# EAGLE design TFG (EAGLE 7.3.0)
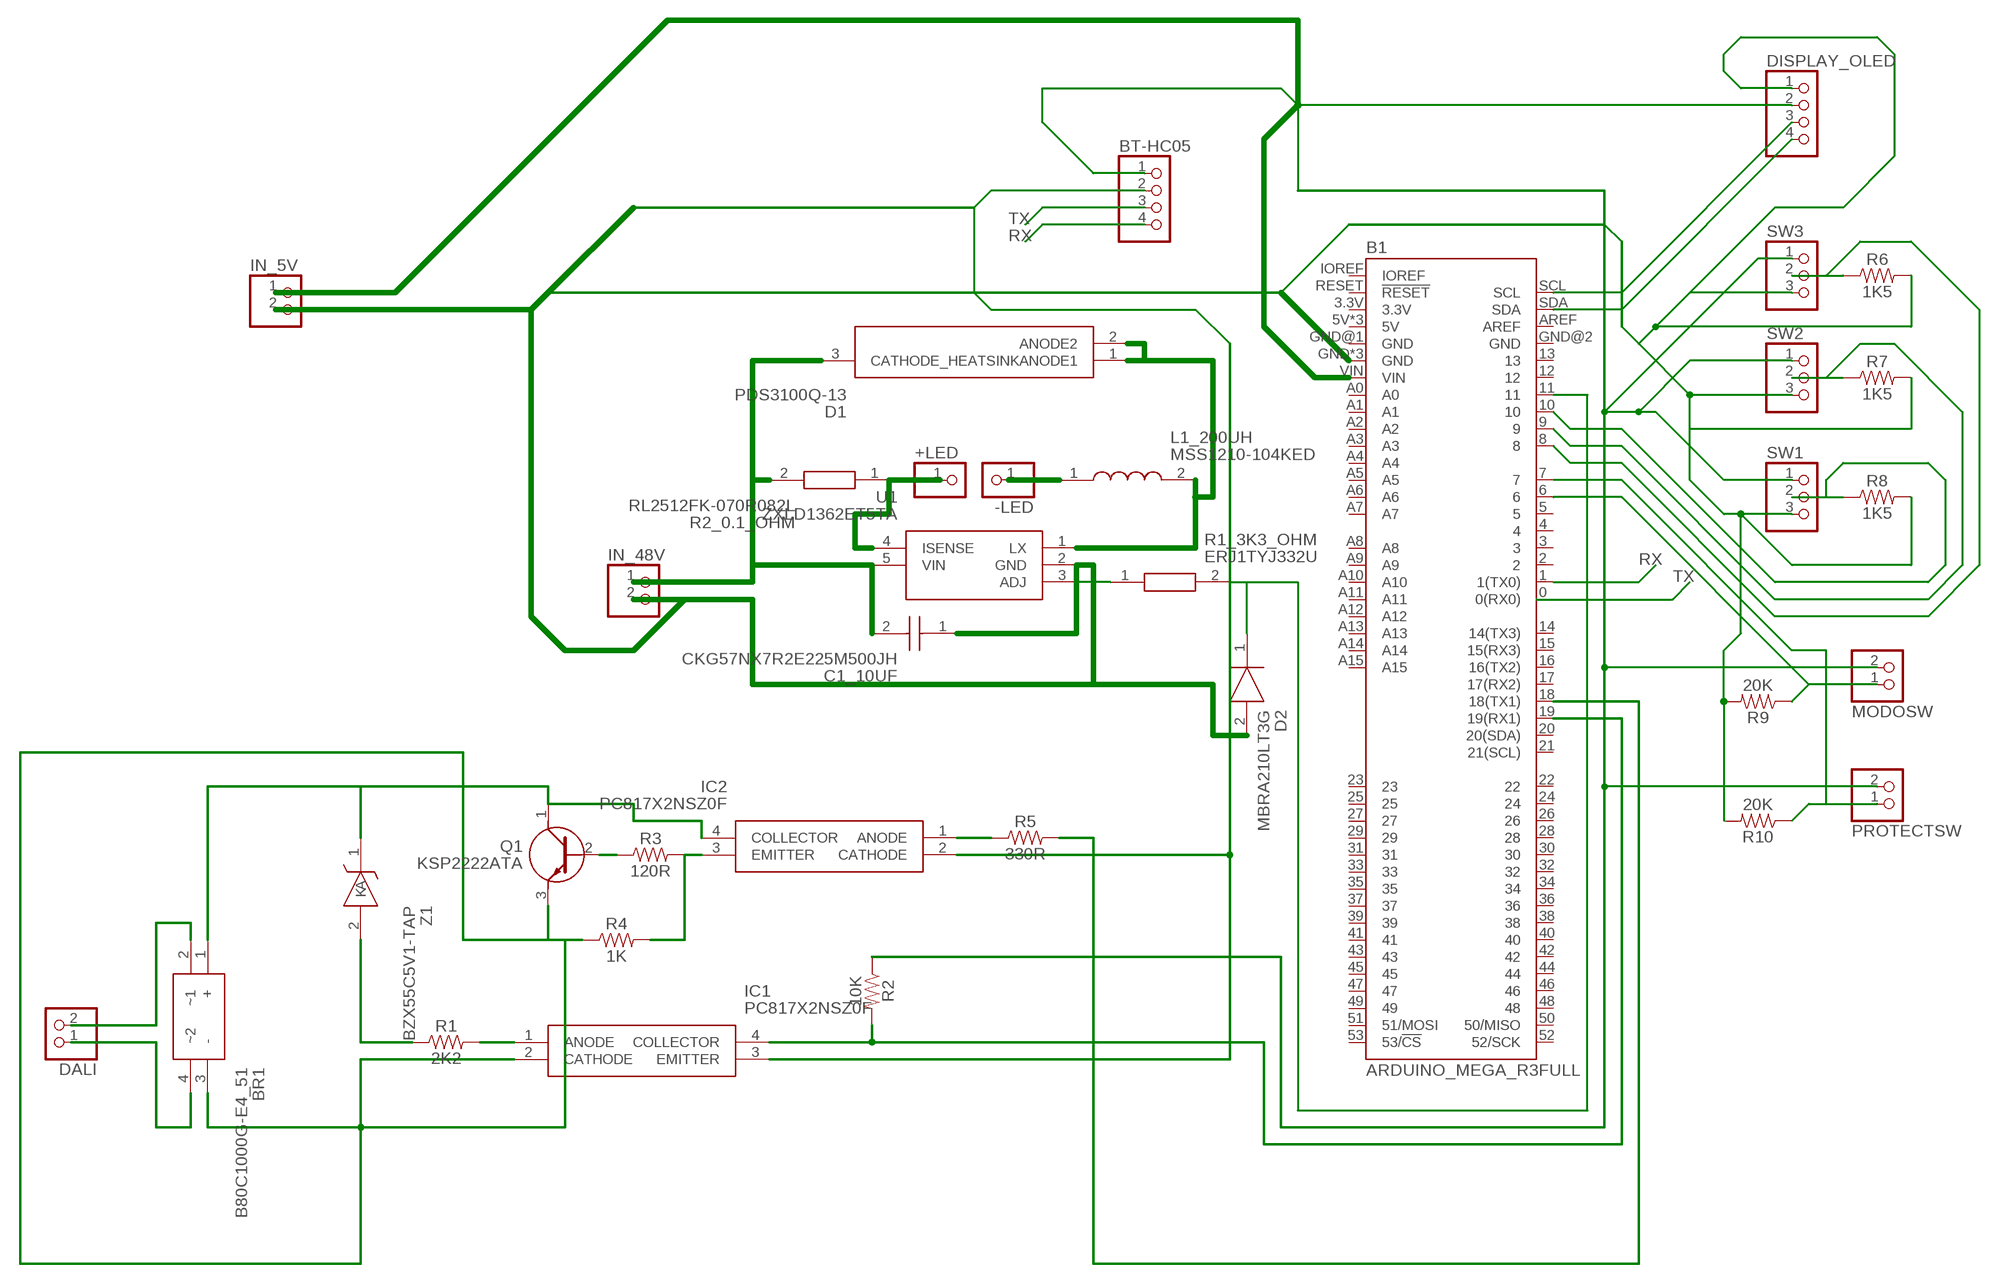
[diagram p0: schematic, sheet 1]

## Parts
+LED  PINHD-1X1  [1X01]
-LED  PINHD-1X1  [1X01]
B1  ARDUINO_MEGA_R3FULL  [ARDUINO_MEGA_NO_SILK]
BR1  B80C1000G-E4_51  [WOG_1]
BT-HC05  PINHD-1X4  [1X04]
C1_10UF  CKG57NX7R2E225M500JH  [CAPC6050X550N]
D1  PDS3100Q-13  [POWERDI5]
D2  MBRA210LT3G  [DIOM5226X220N]
DALI  PINHD-1X2  [1X02]
DISPLAY_OLED  PINHD-1X4  [1X04]
IC1  PC817X2NSZ0F  [DIP762W60P254L458H400Q4N]
IC2  PC817X2NSZ0F  [DIP762W60P254L458H400Q4N]
IN_5V  PINHD-1X2  [1X02]
IN_48V  PINHD-1X2  [1X02]
L1_200UH  MSS1210-104KED  [INDPM120120X1020N]
MODOSW  PINHD-1X2  [1X02]
PROTECTSW  PINHD-1X2  [1X02]
Q1  KSP2222ATA  [TO-92_FAIRCHILD]
R1  2K2  10MOHM-HORIZ-1/4W-5%  [AXIAL-0.3]
R1_3K3_OHM  ERJ1TYJ332U  [RESC6432X70N]
R2  10K  10MOHM-HORIZ-1/4W-5%  [AXIAL-0.3]
R2_0.1_OHM  RL2512FK-070R082L  [RESC6432X65N]
R3  120R  10MOHM-HORIZ-1/4W-5%  [AXIAL-0.3]
R4  1K  10MOHM-HORIZ-1/4W-5%  [AXIAL-0.3]
R5  330R  10MOHM-HORIZ-1/4W-5%  [AXIAL-0.3]
R6  1K5  10MOHM-HORIZ-1/4W-5%  [AXIAL-0.3]
R7  1K5  10MOHM-HORIZ-1/4W-5%  [AXIAL-0.3]
R8  1K5  10MOHM-HORIZ-1/4W-5%  [AXIAL-0.3]
R9  20K  10MOHM-HORIZ-1/4W-5%  [AXIAL-0.3]
R10  20K  10MOHM-HORIZ-1/4W-5%  [AXIAL-0.3]
SW1  PINHD-1X3  [1X03]
SW2  PINHD-1X3  [1X03]
SW3  PINHD-1X3  [1X03]
U1  ZXLD1362ET5TA  [SOT95P270X145-5N]
Z1  BZX55C5V1-TAP  [DIOAD950W60L350D150]

## Nets
2: C1_10UF.2 D1.3(CATHODE_HEATSINK) IN_48V.1 R2_0.1_OHM.2 U1.5(VIN)
N$2: D1.1(ANODE1) D1.2(ANODE2) L1_200UH.2 U1.1(LX)
N$3: B1.GND B1.GND@3(GND) B1.GND@4(GND) BT-HC05.2 C1_10UF.1 D2.2(A) DISPLAY_OLED.1 IC1.3(EMITTER) IC2.2(CATHODE) IN_5V.2 IN_48V.2 R6.P$2 R7.P$2 R8.P$2 R9.P$2 R10.P$2 SW1.3 SW2.3 SW3.3 U1.2(GND)
N$5: -LED.1 L1_200UH.1
N$6: +LED.1 R2_0.1_OHM.1 U1.4(ISENSE)
N$7: B1.9 R7.P$1 SW2.2
N$8: B1.10 R8.P$1 SW1.2
N$9: B1.8 R6.P$1 SW3.2
N$10: R1_3K3_OHM.1 U1.3(ADJ)
N$11: B1.11 D2.1(K) R1_3K3_OHM.2
N$12: BR1.2(~1) DALI.2
N$13: BR1.4(~2) DALI.1
N$14: B1.6 MODOSW.1 R9.P$1
N$15: BR1.1(+) IC2.4(COLLECTOR) Q1.1(C) Z1.1(K)
N$16: R1.P$1 Z1.2(A)
N$17: IC1.1(ANODE) R1.P$2
N$18: B1.19(19(RX1)) IC1.4(COLLECTOR) R2.P$2
N$19: B1.VIN BT-HC05.1 DISPLAY_OLED.2 IN_5V.1 MODOSW.2 PROTECTSW.2 R2.P$1 SW1.1 SW2.1 SW3.1
N$21: IC2.3(EMITTER) R3.P$2 R4.P$2
N$22: Q1.2(B) R3.P$1
N$23: BR1.3(-) IC1.2(CATHODE) Q1.3(E) R4.P$1
N$24: B1.18(18(TX1)) R5.P$2
N$25: IC2.1(ANODE) R5.P$1
N$27: B1.7 PROTECTSW.1 R10.P$1
N$29: B1.SCL DISPLAY_OLED.3
N$30: B1.SDA DISPLAY_OLED.4
RX: B1.1(1(TX0)) BT-HC05.4
TX: BT-HC05.3
Unconnected: B1.0(0(RX0)) B1.2 B1.3 B1.3.3V B1.4 B1.5 B1.5V B1.5V@1(5V) B1.5V@2(5V) B1.12 B1.13 B1.14(14(TX3)) B1.15(15(RX3)) B1.16(16(TX2)) B1.17(17(RX2)) B1.20(20(SDA)) B1.21(21(SCL)) B1.22 B1.23 B1.24 B1.25 B1.26 B1.27 B1.28 B1.29 B1.30 B1.31 B1.32 B1.33 B1.34 B1.35 B1.36 B1.37 B1.38 B1.39 B1.40 B1.41 B1.42 B1.43 B1.44 B1.45 B1.46 B1.47 B1.48 B1.49 B1.50(50/MISO) B1.51(51/MOSI) B1.52(52/SCK) B1.53(53/!CS) B1.A0 B1.A1 B1.A2 B1.A3 B1.A4 B1.A5 B1.A6 B1.A7 B1.A8 B1.A9 B1.A10 B1.A11 B1.A12 B1.A13 B1.A14 B1.A15 B1.AREF B1.GND@1(GND) B1.GND@2(GND) B1.IOREF B1.RESET(!RESET)

## Library data of the parts
+LED -LED = pinhead:PINHD-1X1: PIN HEADER
B1 = SparkFun-Boards:ARDUINO_MEGA_R3: Arduino Mega R3 ATmega2560 R3 compatible footprint. SparkFun Products: Arduino Mega 2560 R3 <https://www.sparkfun.com/products/11061>
BR1 = LibABL:B80C1000G-E4_51: Vishay B80C1000G-E4/51, Bridge Rectifier, 1.2A 125V, 4-Pin WOG Source: Datasheet <http://www.vishay.com/docs/88500/b40c1000g.pdf>; ARROW_PART_NUMBER: B80C1000G-E4/51; ARROW_PRICE/STOCK: http://uk.rs-online.com/web/p/products/1656361; DESCRIPTION: Vishay B80C1000G-E4/51, Bridge Rectifier, 1.2A 125V, 4-Pin WOG; HEIGHT: mm; MANUFACTURER_NAME: Vishay; MANUFACTURER_PART_NUMBER: B80C1000G-E4/51; RS_PART_NUMBER: 1656361; RS_PRICE/STOCK: http://uk.rs-online.com/web/p/products/1656361
BT-HC05 DISPLAY_OLED = pinhead:PINHD-1X4: PIN HEADER
C1_10UF = LibABL:CKG57NX7R2E225M500JH: 2220 X7R Ceramic Capacitor 250V 2.2uF TDK 2.2F Multilayer Ceramic Capacitor (MLCC) 250 V 20% X7R dielectric CKG Surface Mount max op. temp. +125C Source: Datasheet <https://product.tdk.com/info/en/catalog/datasheets/mlcc_commercial_megacap_en.pdf>; ARROW_PART_NUMBER: CKG57NX7R2E225M500JH; ARROW_PRICE/STOCK: https://www.arrow.com/en/products/ckg57nx7r2e225m500jh/tdk; DESCRIPTION: 2220 X7R Ceramic Capacitor 250V 2.2uF TDK 2.2F Multilayer Ceramic Capacitor (MLCC) 250 V 20% X7R dielectric CKG Surface Mount max op. temp. +125C; HEIGHT: 5.5mm; MANUFACTURER_NAME: TDK; MANUFACTURER_PART_NUMBER: CKG57NX7R2E225M500JH; RS_PART_NUMBER: 9214328; RS_PRICE/STOCK: http://uk.rs-online.com/web/p/products/9214328
D1 = LibABL:PDS3100Q-13: Schottky Diodes & Rectifiers Source: Datasheet <https://www.diodes.com/assets/Datasheets/PDS3100Q.pdf>; ARROW_PART_NUMBER: PDS3100Q-13; ARROW_PRICE/STOCK: https://www.arrow.com/en/products/pds3100q-13/diodes-incorporated; DESCRIPTION: Schottky Diodes & Rectifiers; HEIGHT: mm; MANUFACTURER_NAME: Diodes Inc.; MANUFACTURER_PART_NUMBER: PDS3100Q-13
D2 = LibABL:MBRA210LT3G: Source: Datasheet <http://www.onsemi.com/pub/Collateral/MBRA210LT3-D.PDF>; ALLIED_NUMBER: 70339903; ALLIED_PRICE/STOCK: http://www.alliedelec.com/on-semiconductor-mbra210lt3g/70339903/; ARROW_PART_NUMBER: MBRA210LT3G; ARROW_PRICE/STOCK: https://www.arrow.com/en/products/mbra210lt3g/on-semiconductor; HEIGHT: 2.2mm; MANUFACTURER_NAME: ON Semiconductor; MANUFACTURER_PART_NUMBER: MBRA210LT3G; RS_PART_NUMBER: 7925612P; RS_PRICE/STOCK: http://uk.rs-online.com/web/p/products/7925612P
DALI IN_5V IN_48V MODOSW PROTECTSW = pinhead:PINHD-1X2: PIN HEADER
IC1 IC2 = LibABL:PC817X2NSZ0F: Photocoupler 1-CH Transistor 4-Pin PDIP Sharp PC817X2NSZ0F DC Input Transistor Output Optocoupler, Through Hole, 4-Pin PDIP Source: Datasheet <http://www.sharp-world.com/products/device/lineup/data/pdf/datasheet/pc817xnnsz_e.pdf>; ARROW_PART_NUMBER: PC817X2NSZ0F; ARROW_PRICE/STOCK: http://uk.rs-online.com/web/p/products/8264687P; DESCRIPTION: Photocoupler 1-CH Transistor 4-Pin PDIP Sharp PC817X2NSZ0F DC Input Transistor Output Optocoupler, Through Hole, 4-Pin PDIP; HEIGHT: 4mm; MANUFACTURER_NAME: Sharp Microelectronics; MANUFACTURER_PART_NUMBER: PC817X2NSZ0F; RS_PART_NUMBER: 8264687P; RS_PRICE/STOCK: http://uk.rs-online.com/web/p/products/8264687P
L1_200UH = LibABL:MSS1210-104KED: COILCRAFT - MSS1210-104KED - INDUCTOR, PWR, 100UH,3.4A,10%,3.6MHZ Source: Datasheet <http://www.coilcraft.com/pdfs/MSS1210.pdf>; ARROW_PART_NUMBER: MSS1210-104KED; DESCRIPTION: COILCRAFT - MSS1210-104KED - INDUCTOR, PWR, 100UH,3.4A,10%,3.6MHZ; HEIGHT: 10.2mm; MANUFACTURER_NAME: COILCRAFT; MANUFACTURER_PART_NUMBER: MSS1210-104KED
Q1 = LibABL:KSP2222ATA: Transistor GP BJT NPN 40V 0.6A TO92-3 Source: Datasheet <http://docs-europe.electrocomponents.com/webdocs/0f9b/0900766b80f9b313.pdf>; ARROW_PART_NUMBER: KSP2222ATA; ARROW_PRICE/STOCK: http://uk.rs-online.com/web/p/bipolar-transistors/7390417/?source=DS; DESCRIPTION: Transistor GP BJT NPN 40V 0.6A TO92-3; HEIGHT: mm; MANUFACTURER_NAME: Fairchild Semiconductor; MANUFACTURER_PART_NUMBER: KSP2222ATA; RS_PART_NUMBER: 7390417; RS_PRICE/STOCK: http://uk.rs-online.com/web/p/bipolar-transistors/7390417/?source=DS
R1-R10 = SparkFun-Resistors:10MOHM: RES-09327; PROD_ID: RES-09327; VALUE: 10M
R1_3K3_OHM = LibABL:ERJ1TYJ332U: PANASONIC ELECTRONIC COMPONENTS - ERJ1TYJ332U - RES, THICK FILM, 3K3, 5%, 1W, 2512 Source: Datasheet <https://industrial.panasonic.com/cdbs/www-data/pdf/RDA0000/AOA0000C84.pdf>; ARROW_PART_NUMBER: ERJ1TYJ332U; DESCRIPTION: PANASONIC ELECTRONIC COMPONENTS - ERJ1TYJ332U - RES, THICK FILM, 3K3, 5%, 1W, 2512; HEIGHT: 0.7mm; MANUFACTURER_NAME: Panasonic; MANUFACTURER_PART_NUMBER: ERJ1TYJ332U
R2_0.1_OHM = LibABL:RL2512FK-070R082L: Current Sense Resistors - SMD 0.082 Ohm 1% 1W Source: Datasheet <https://www.mouser.com/ds/2/447/PYu-RL_521_RoHS_L_5-2927.pdf>; ARROW_PART_NUMBER: RL2512FK-070R082L; DESCRIPTION: Current Sense Resistors - SMD 0.082 Ohm 1% 1W; HEIGHT: 0.65mm; MANUFACTURER_NAME: YAGEO (PHYCOMP); MANUFACTURER_PART_NUMBER: RL2512FK-070R082L
SW1-SW3 = pinhead:PINHD-1X3: PIN HEADER
U1 = LibABL:ZXLD1362ET5TA: 60V 1A LED DRIVER WITH AEC-Q100 Source: Datasheet <http://componentsearchengine.com/Datasheets/1/ZXLD1362ET5TA.pdf>; ARROW_PART_NUMBER: ZXLD1362ET5TA; ARROW_PRICE/STOCK: https://www.arrow.com/en/products/zxld1362et5ta/diodes-incorporated; DESCRIPTION: 60V 1A LED DRIVER WITH AEC-Q100; HEIGHT: mm; MANUFACTURER_NAME: Diodes Inc.; MANUFACTURER_PART_NUMBER: ZXLD1362ET5TA; RS_PART_NUMBER: 1219947; RS_PRICE/STOCK: http://uk.rs-online.com/web/p/products/1219947
Z1 = LibABL:BZX55C5V1-TAP: Vishay Zener Diode, 5.1V 6% 500 mW Through Hole 2-Pin DO-35 Source: Datasheet <http://www.farnell.com/datasheets/2046255.pdf>; ARROW_PART_NUMBER: BZX55C5V1-TAP; ARROW_PRICE/STOCK: https://www.arrow.com/en/products/bzx55c5v1-tap/vishay; DESCRIPTION: Vishay Zener Diode, 5.1V 6% 500 mW Through Hole 2-Pin DO-35; HEIGHT: mm; MANUFACTURER_NAME: Vishay; MANUFACTURER_PART_NUMBER: BZX55C5V1-TAP; RS_PART_NUMBER: 6997809P; RS_PRICE/STOCK: http://uk.rs-online.com/web/p/products/6997809P

## Board
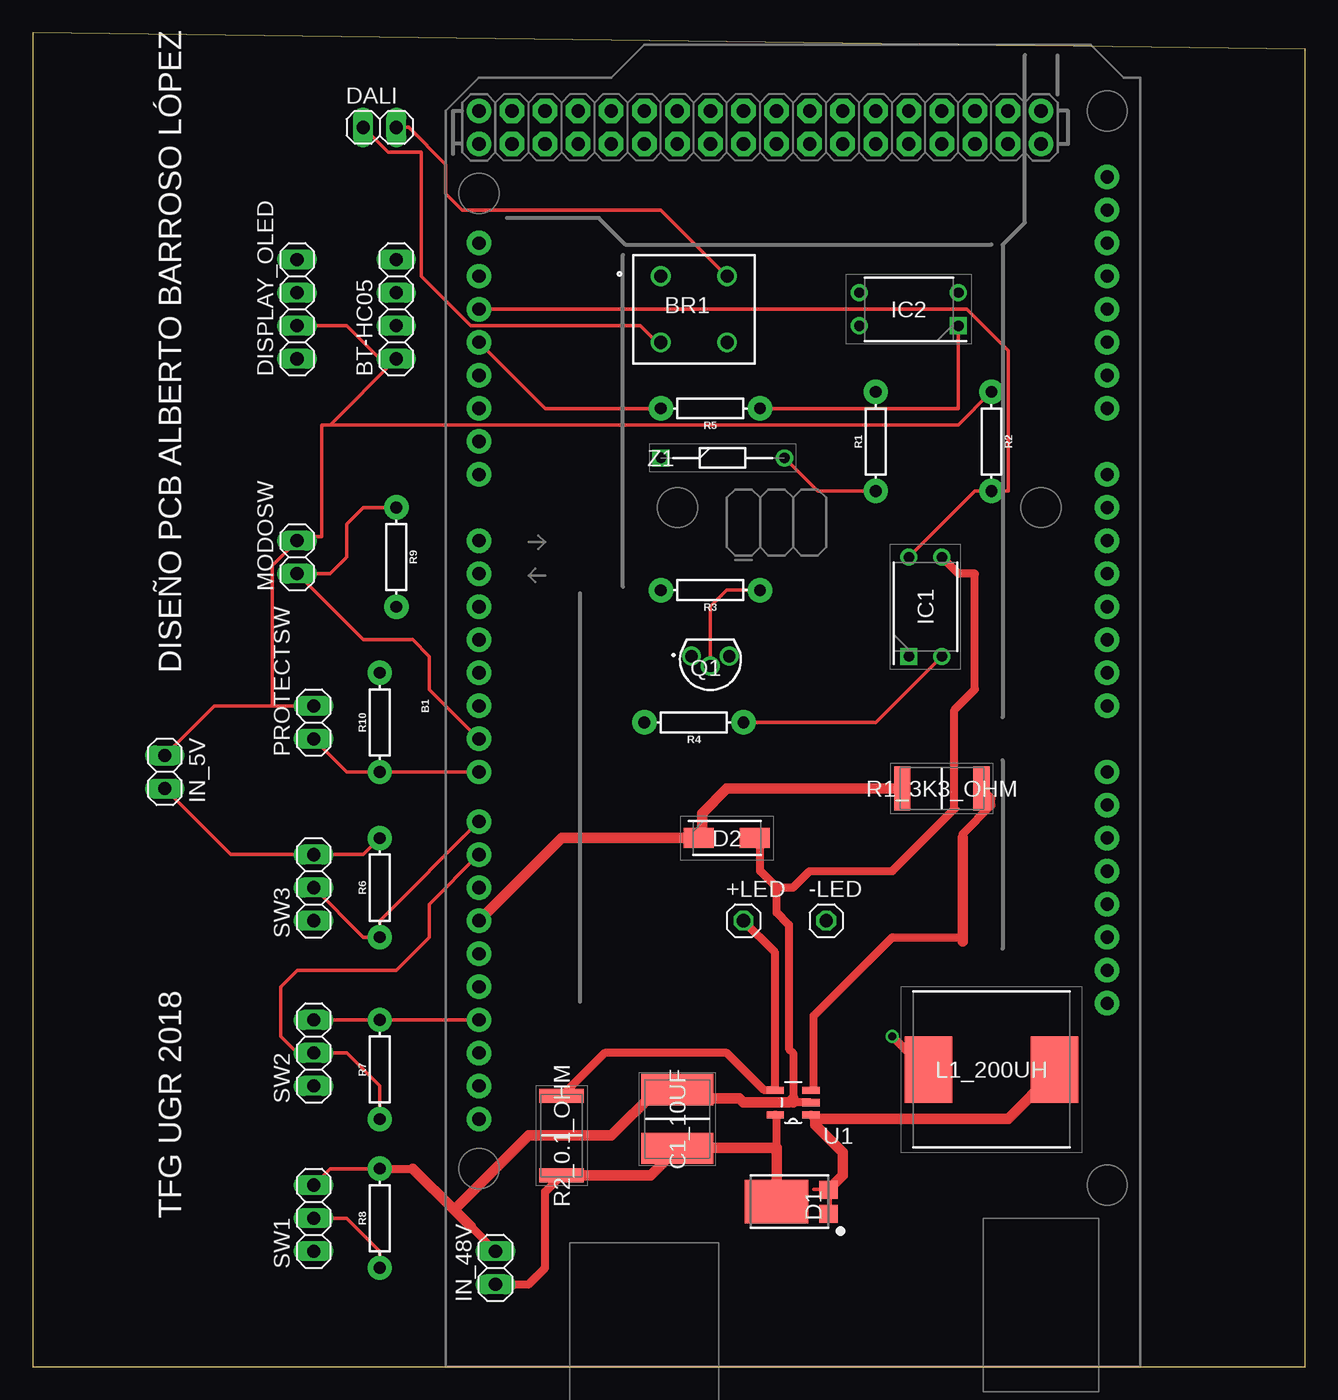
[diagram p1: board, top side]
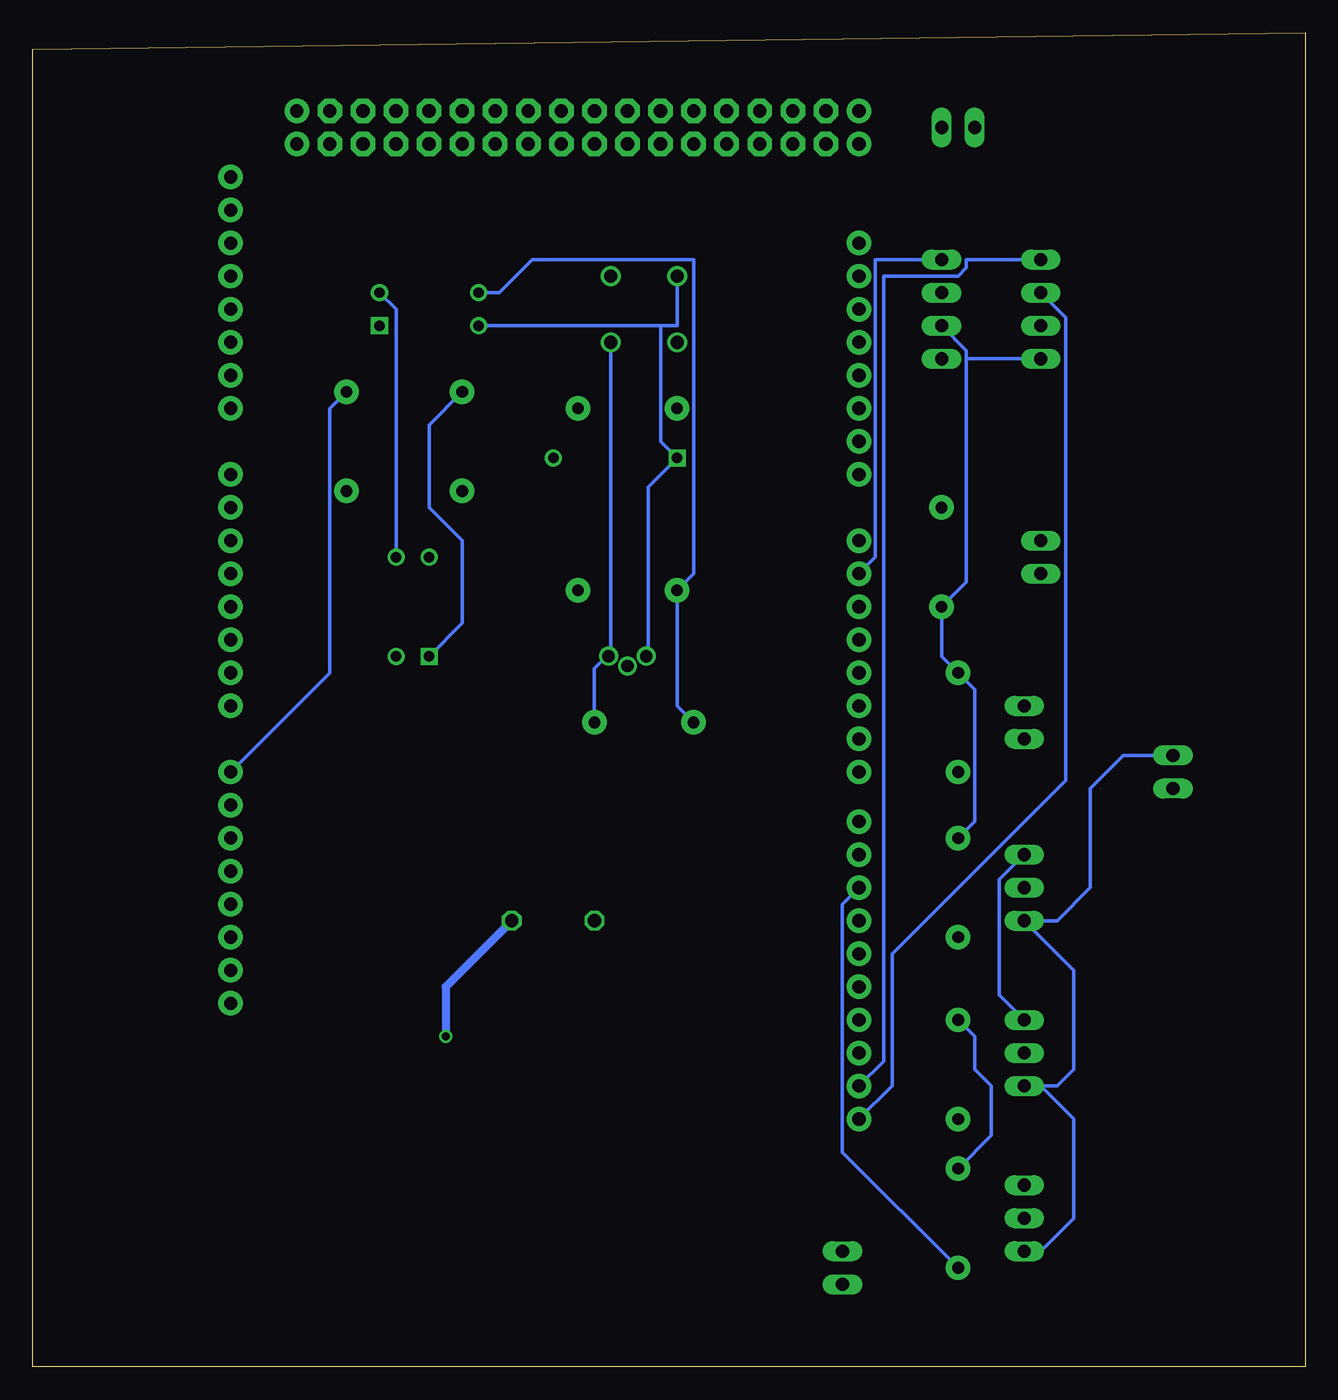
[diagram p2: board, bottom side, seen from below]

Size 97.77 x 102.54 mm. Coordinates in mm from the lower left corner, seen from the top.
Outline: 0,0 97.77,0 97.77,101.27 0,102.54 0,0
Copper layers (1*16): Top 0.035mm / dielectric 1.5mm / Bottom 0.035mm
Design rules "default": minimum track width 10mil, minimum drill 24mil, track to track 8mil, track to pad 8mil, pad to pad 8mil, via to via 8mil, smd to smd 8mil, copper to edge 40mil, drill to drill 8mil, minimum pad ring 10mil, minimum via ring 8mil, stop-mask expansion 4mil, vias tented up to drill 0mil, thermal gap 10mil

### Footprints (pad centres in the part's own frame; a part is rotated, then mirrored left to right if it is on the bottom)
1X01 = drill 1.016 octagon: 1 0,0
ARDUINO_MEGA_NO_SILK = drill 1.016 pad 1.88: 0 13.97,24.13; 1 11.43,24.13; 2 8.89,24.13; 3 6.35,24.13; 3.3V -13.97,-24.13; 4 3.81,24.13; 5 1.27,24.13; 5V -11.43,-24.13; 5V@1 44.45,24.13; 5V@2 46.99,24.13; 6 -1.27,24.13; 7 -3.81,24.13; 8 -7.62,24.13; 9 -10.16,24.13; 10 -12.7,24.13; 11 -15.24,24.13; 12 -17.78,24.13; 13 -20.32,24.13; 14 19.05,24.13; 15 21.59,24.13; 16 24.13,24.13; 17 26.67,24.13; 18 29.21,24.13; 19 31.75,24.13; 20 34.29,24.13; 21 36.83,24.13; A0 1.27,-24.13; A1 3.81,-24.13; A2 6.35,-24.13; A3 8.89,-24.13; A4 11.43,-24.13; A5 13.97,-24.13; A6 16.51,-24.13; A7 19.05,-24.13; A8 24.13,-24.13; A9 26.67,-24.13; A10 29.21,-24.13; A11 31.75,-24.13; A12 34.29,-24.13; A13 36.83,-24.13; A14 39.37,-24.13; A15 41.91,-24.13; AREF -25.4,24.13; GND -8.89,-24.13; GND@1 -6.35,-24.13; GND@2 44.45,-19.05; GND@3 46.99,-19.05; GND@4 -22.86,24.13; IOREF -19.05,-24.13; NC -21.59,-24.13; RESET -16.51,-24.13; SCL -30.48,24.13; SDA -27.94,24.13; VIN -3.81,-24.13 | drill 1.016 pad 1.88 octagon: 22 44.45,21.59; 23 46.99,21.59; 24 44.45,19.05; 25 46.99,19.05; 26 44.45,16.51; 27 46.99,16.51; 28 44.45,13.97; 29 46.99,13.97; 30 44.45,11.43; 31 46.99,11.43; 32 44.45,8.89; 33 46.99,8.89; 34 44.45,6.35; 35 46.99,6.35; 36 44.45,3.81; 37 46.99,3.81; 38 44.45,1.27; 39 46.99,1.27; 40 44.45,-1.27; 41 46.99,-1.27; 42 44.45,-3.81; 43 46.99,-3.81; 44 44.45,-6.35; 45 46.99,-6.35; 46 44.45,-8.89; 47 46.99,-8.89; 48 44.45,-11.43; 49 46.99,-11.43; 50 44.45,-13.97; 51 46.99,-13.97; 52 44.45,-16.51; 53 46.99,-16.51
WOG_1 = drill 1.01 pad 1.51: 1 -2.55,2.55; 2 2.55,2.55; 3 2.55,-2.55; 4 -2.55,-2.55
1X04 = drill 1.016 long: 1 -3.81,0; 2 -1.27,0; 3 1.27,0; 4 3.81,0
CAPC6050X550N = smd 2.39 x 5.51: 1 -2.26,0; 2 2.26,0
POWERDI5 = smd 1.39 x 1.4: 1 -0.92,-3.982; 2 0.92,-3.982 | smd 3.36 x 4.86: 3 0,0
DIOM5226X220N = smd 2.3 x 1.55: 1 -2.15,0; 2 2.15,0
1X02 = drill 1.016 long: 1 -1.27,0; 2 1.27,0
DIP762W60P254L458H400Q4N = drill 0.8 pad 1.2 square: 1 -3.81,1.27 | drill 0.8 pad 1.2: 2 -3.81,-1.27; 3 3.81,-1.27; 4 3.81,1.27
INDPM120120X1020N = smd 3.65 x 5.1: 1 -4.85,0; 2 4.85,0
TO-92_FAIRCHILD = drill 0.94 pad 1.44: 1 -1.45,-1.26; 2 0,-2.01; 3 1.45,-1.26
AXIAL-0.3 = drill 0.9 pad 1.88: P$1 -3.81,0; P$2 3.81,0
RESC6432X70N = smd 1.25 x 3.4: 1 -3.05,0; 2 3.05,0
RESC6432X65N = smd 1.1 x 3.4: 1 -3.05,0; 2 3.05,0
1X03 = drill 1.016 long: 1 -2.54,0; 2 0,0; 3 2.54,0
SOT95P270X145-5N = smd 1.321 x 0.559: 1 -1.372,0.94; 2 -1.372,0; 3 -1.372,-0.94; 4 1.372,-0.94; 5 1.372,0.94
DIOAD950W60L350D150 = drill 0.8 pad 1.2 square: 1 0,0 | drill 0.8 pad 1.2: 2 9.5,0

### Placement (x,y rotation side)
+LED  54.61,34.29 0 top
-LED  60.96,34.29 0 top
B1  58.42,49.53 90 top
BR1  50.8,81.28 0 top
BT-HC05  27.94,81.28 90 top
C1_10UF  49.53,19.05 270 top
D1  57.15,12.7 90 top
D2  53.34,40.64 0 top
DALI  26.67,95.25 0 top
DISPLAY_OLED  20.32,81.28 90 top
IC1  68.58,58.42 90 top
IC2  67.31,81.28 180 top
IN_5V  10.16,45.72 270 top
IN_48V  35.56,7.62 90 top
L1_200UH  73.66,22.86 0 top
MODOSW  20.32,62.23 90 top
PROTECTSW  21.59,49.53 90 top
Q1  52.07,55.88 0 top
R1  64.77,71.12 90 top
R1_3K3_OHM  69.85,44.45 180 top
R2  73.66,71.12 270 top
R2_0.1_OHM  40.64,17.78 270 top
R3  52.07,59.69 180 top
R4  50.8,49.53 180 top
R5  52.07,73.66 180 top
R6  26.67,36.83 90 top
R7  26.67,22.86 90 top
R8  26.67,11.43 90 top
R9  27.94,62.23 270 top
R10  26.67,49.53 90 top
SW1  21.59,11.43 90 top
SW2  21.59,24.13 90 top
SW3  21.59,36.83 90 top
U1  58.42,20.32 180 top
Z1  48.26,69.85 0 top

### Tracks (layer width: path | path; a pad name or v marks a point on that pad's centre or on a via)
2
  Top 0.254: 49.53,16.83 C1_10UF.2
  Top 0.61: 57.15,16.83 57.15,19.37 57.06,19.37 U1.5 | IN_48V.1 38.1,6.35 39.37,7.62 39.37,13.46 R2_0.1_OHM.2
  Top 0.813: D1.3 57.15,16.83 49.53,16.83 | R2_0.1_OHM.2 47.47,14.73 C1_10UF.2
N$2
  Top 0.254: 60.01,13.65 60.96,13.65 D1.2 61.28,13.34 61.28,12.06 D1.1 | 78.42,22.86 L1_200UH.2
  Top 0.61: U1.1 60.12,19.05
  Top 0.813: 78.42,22.86 78.42,22.54 74.93,19.05 60.12,19.05 60.12,18.62 62.23,16.51 62.23,14.72 D1.2
N$3
  Top 0.254: 58.1,20.64 58.42,20.64 | 50.17,20.64 49.53,21.27 C1_10UF.1 | 55.56,40.64 D2.2 | 70.8,42.86 71.12,42.86 | SW2.3 R7.P$2 B1.GND@4 | SW1.3 22.86,15.24 R8.P$2 | IN_5V.2 15.24,39.37 SW3.3 25.4,39.37 R6.P$2
  Top 0.61: 33.66,10.79 IN_48V.2 | R8.P$2 29.21,15.24 | U1.2 58.42,20.32 58.42,24.13 58.1,24.45 58.1,33.97 57.15,34.92 57.15,36.83 | 57.15,36.83 55.88,38.1 55.88,40.25 D2.2 | 57.15,36.83 58.42,36.83 59.69,38.1 66.04,38.1 70.8,42.86 70.8,50.48 72.39,52.07 72.39,60.96 71.12,60.96 IC1.3
  Top 0.813: 29.21,15.24 32.38,12.06 | 32.38,12.06 33.66,10.79 | 50.17,20.64 54.29,20.64 54.61,20.32 58.1,20.32 58.26,20.48 | 58.26,20.48 58.42,20.64 | 58.42,20.32 58.26,20.48 | 49.53,21.27 47.94,21.27 44.45,17.78 38.1,17.78 32.38,12.06
  Bottom 0.254: IC1.3 69.85,81.28 IC2.2 | R7.P$2 25.4,25.4 25.4,22.86 24.13,21.59 24.13,17.78 R8.P$2 | 26.04,77.47 DISPLAY_OLED.1 | 26.04,77.47 26.04,78.11 BT-HC05.2 | R6.P$2 25.4,41.91 25.4,52.07 R10.P$2 27.94,54.61 R9.P$2 26.04,60.33 26.04,77.47 | SW2.3 23.49,28.57 23.49,37.47 SW3.3
N$5  (via drill 0.61)
  Top 0.254: 68.58,22.86 L1_200UH.1
  Top 0.61: 68.58,22.86 v66.04,25.4
  Bottom 0.61: -LED.1 66.04,29.21 v66.04,25.4
N$6
  Top 0.61: +LED.1 57.05,31.85 U1.4 56.21,21.26 53.34,24.13 43.94,24.13 R2_0.1_OHM.1
N$7
  Top 0.254: R7.P$1 26.67,21.59 24.13,24.13 SW2.2 20.32,24.13 19.05,25.4 19.05,29.21 20.32,30.48 27.94,30.48 30.48,33.02 30.48,35.56 B1.9
N$8
  Top 0.254: R8.P$1 26.67,8.89 24.13,11.43 SW1.2
  Bottom 0.254: B1.10 35.56,35.56 35.56,16.51 R8.P$1
N$9
  Top 0.254: SW3.2 25.4,33.02 R6.P$1 26.67,34.29 B1.8
N$10
  Top 0.254: 60.01,21.27 U1.3
  Top 0.61: 60.01,21.27 60.01,26.99 66.04,33.02 71.44,33.02 | 71.44,40.64 71.44,40.96 73.66,43.18 73.66,43.69 R1_3K3_OHM.1
  Top 0.813: 71.44,40.64 71.44,33.02 71.44,32.7
N$11
  Top 0.254: 51.44,40.64 D2.1
  Top 0.813: B1.11 40.64,40.64 D2.1 | 51.44,40.64 51.44,42.55 53.34,44.45 R1_3K3_OHM.2
N$12
  Top 0.254: DALI.2 28.89,95.25 31.75,92.39 31.75,90.17 33.02,88.9 48.26,88.9 53.33,83.83 BR1.2
N$13
  Top 0.254: DALI.1 27.3,93.34 29.84,93.34 29.84,83.82 33.66,80.01 46.67,80.01 47.94,78.74 BR1.4
N$14
  Top 0.254: B1.6 30.48,52.07 30.48,54.61 29.21,55.88 25.4,55.88 MODOSW.1 22.86,60.96 24.13,62.23 24.13,64.77 25.4,66.04 R9.P$1
N$15
  Bottom 0.254: Q1.1 50.48,54.93 50.48,67.63 Z1.1 49.53,71.12 49.53,80.01 | 49.53,80.01 48.26,80.01 BR1.1 | 49.53,80.01 IC2.4
N$16
  Top 0.254: R1.P$1 60.33,67.31 57.78,69.85 Z1.2
N$17
  Bottom 0.254: IC1.1 64.77,57.15 64.77,63.5 67.31,66.04 67.31,72.39 R1.P$2
N$18
  Top 0.254: IC1.4 72.39,67.31 R2.P$2 74.93,67.31 74.93,78.11 71.75,81.28 B1.19
N$19
  Top 0.254: IN_5V.1 13.97,50.8 18.41,50.8 | PROTECTSW.2 18.41,50.8 | 18.41,50.8 18.41,61.59 MODOSW.2 20.64,63.82 22.23,63.82 22.23,72.39 22.86,72.39 | R2.P$1 71.12,72.39 22.86,72.39 | 22.86,72.39 BT-HC05.1 26.67,77.47 24.13,80.01 DISPLAY_OLED.2
  Bottom 0.254: B1.VIN 74.93,53.34 74.93,73.66 R2.P$1 | SW1.1 20.32,8.89 17.78,11.43 17.78,19.05 20.32,21.59 | 20.32,21.59 SW2.1 | 20.32,21.59 19.05,21.59 17.78,22.86 17.78,30.48 SW3.1 19.05,34.29 16.51,36.83 16.51,44.45 13.97,46.99 IN_5V.1
N$21
  Bottom 0.254: IC2.3 61.91,82.55 59.37,85.09 46.99,85.09 46.99,60.96 R3.P$2 48.26,50.8 R4.P$2
N$22
  Top 0.254: Q1.2 52.07,58.42 53.34,59.69 R3.P$1
N$23
  Top 0.254: IC1.2 64.77,49.53 R4.P$1
  Bottom 0.254: R4.P$1 54.61,53.66 53.66,54.61 Q1.3 53.34,54.93 53.34,78.42 BR1.3
N$24
  Top 0.254: B1.18 39.37,73.66 R5.P$2
N$25
  Top 0.254: IC2.1 71.12,73.66 R5.P$1
N$27
  Top 0.254: PROTECTSW.1 24.13,45.72 R10.P$1 B1.7
N$29
  Bottom 0.254: DISPLAY_OLED.3 18.41,80.64 18.41,45.09 31.75,31.75 31.75,21.59 B1.SCL
N$30
  Bottom 0.254: DISPLAY_OLED.4 26.04,85.09 26.04,84.45 26.67,83.82 32.38,83.82 32.38,23.5 B1.SDA
RX
  Bottom 0.254: BT-HC05.4 33.02,85.09 33.02,62.23 B1.1

### Text on the board
tNames: DISEÑO PCB ALBERTO BARROSO LÓPEZ | TFG UGR 2018